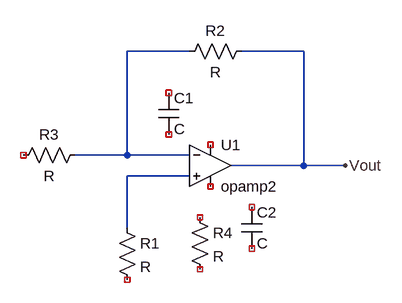
[diagram p0: schematic Draft18.asc]
Draft18.asc, the LTspice schematic file:
Version 4
SHEET 1 880 680
WIRE 336 96 240 96
WIRE 512 96 416 96
WIRE 240 256 240 96
WIRE 240 256 160 256
WIRE 336 256 240 256
WIRE 512 272 512 96
WIRE 512 272 400 272
WIRE 576 272 512 272
WIRE 336 288 240 288
WIRE 240 368 240 288
FLAG 576 272 Vout
SYMBOL OpAmps/opamp2 368 208 R0
SYMATTR InstName U1
SYMBOL res 224 352 R0
SYMATTR InstName R1
SYMBOL res 432 80 R90
WINDOW 0 0 56 VBottom 2
WINDOW 3 32 56 VTop 2
SYMATTR InstName R2
SYMBOL res 176 240 R90
WINDOW 0 0 56 VBottom 2
WINDOW 3 32 56 VTop 2
SYMATTR InstName R3
SYMBOL cap 288 160 R0
SYMATTR InstName C1
SYMBOL cap 416 336 R0
SYMATTR InstName C2
SYMBOL res 336 336 R0
SYMATTR InstName R4

The netlist it stands for:
* Draft18.asc
XU1 N002 N001 NC_01 NC_02 Vout opamp2  ; pins In+ In- V+ V- OUT
R1 N002 NC_03 R
R2 Vout N001 R
R3 N001 NC_04 R
C1 NC_05 NC_06 C
C2 NC_07 NC_08 C
R4 NC_09 NC_10 R
.backanno
.end